# EAGLE design LED_resistor (EAGLE 6.4)
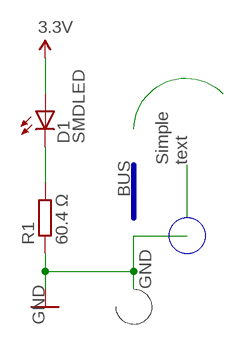
[diagram p0: schematic, sheet 1]

## Parts
D1  SMDLED  [1206]
R1  60.4 Ω  R-EU_R0805  [R0805]

## Nets
3.3V: D1.1(A)
GND: R1.1
N$1: D1.2(C) R1.2

## Buses
BUS

## Notes on the sheet
- Simple
  text

## Library data of the parts
D1 = jenswilly_custom:SMDLED: SMD LED
R1 = rcl:R-EU_: RESISTOR, European symbol

## Board
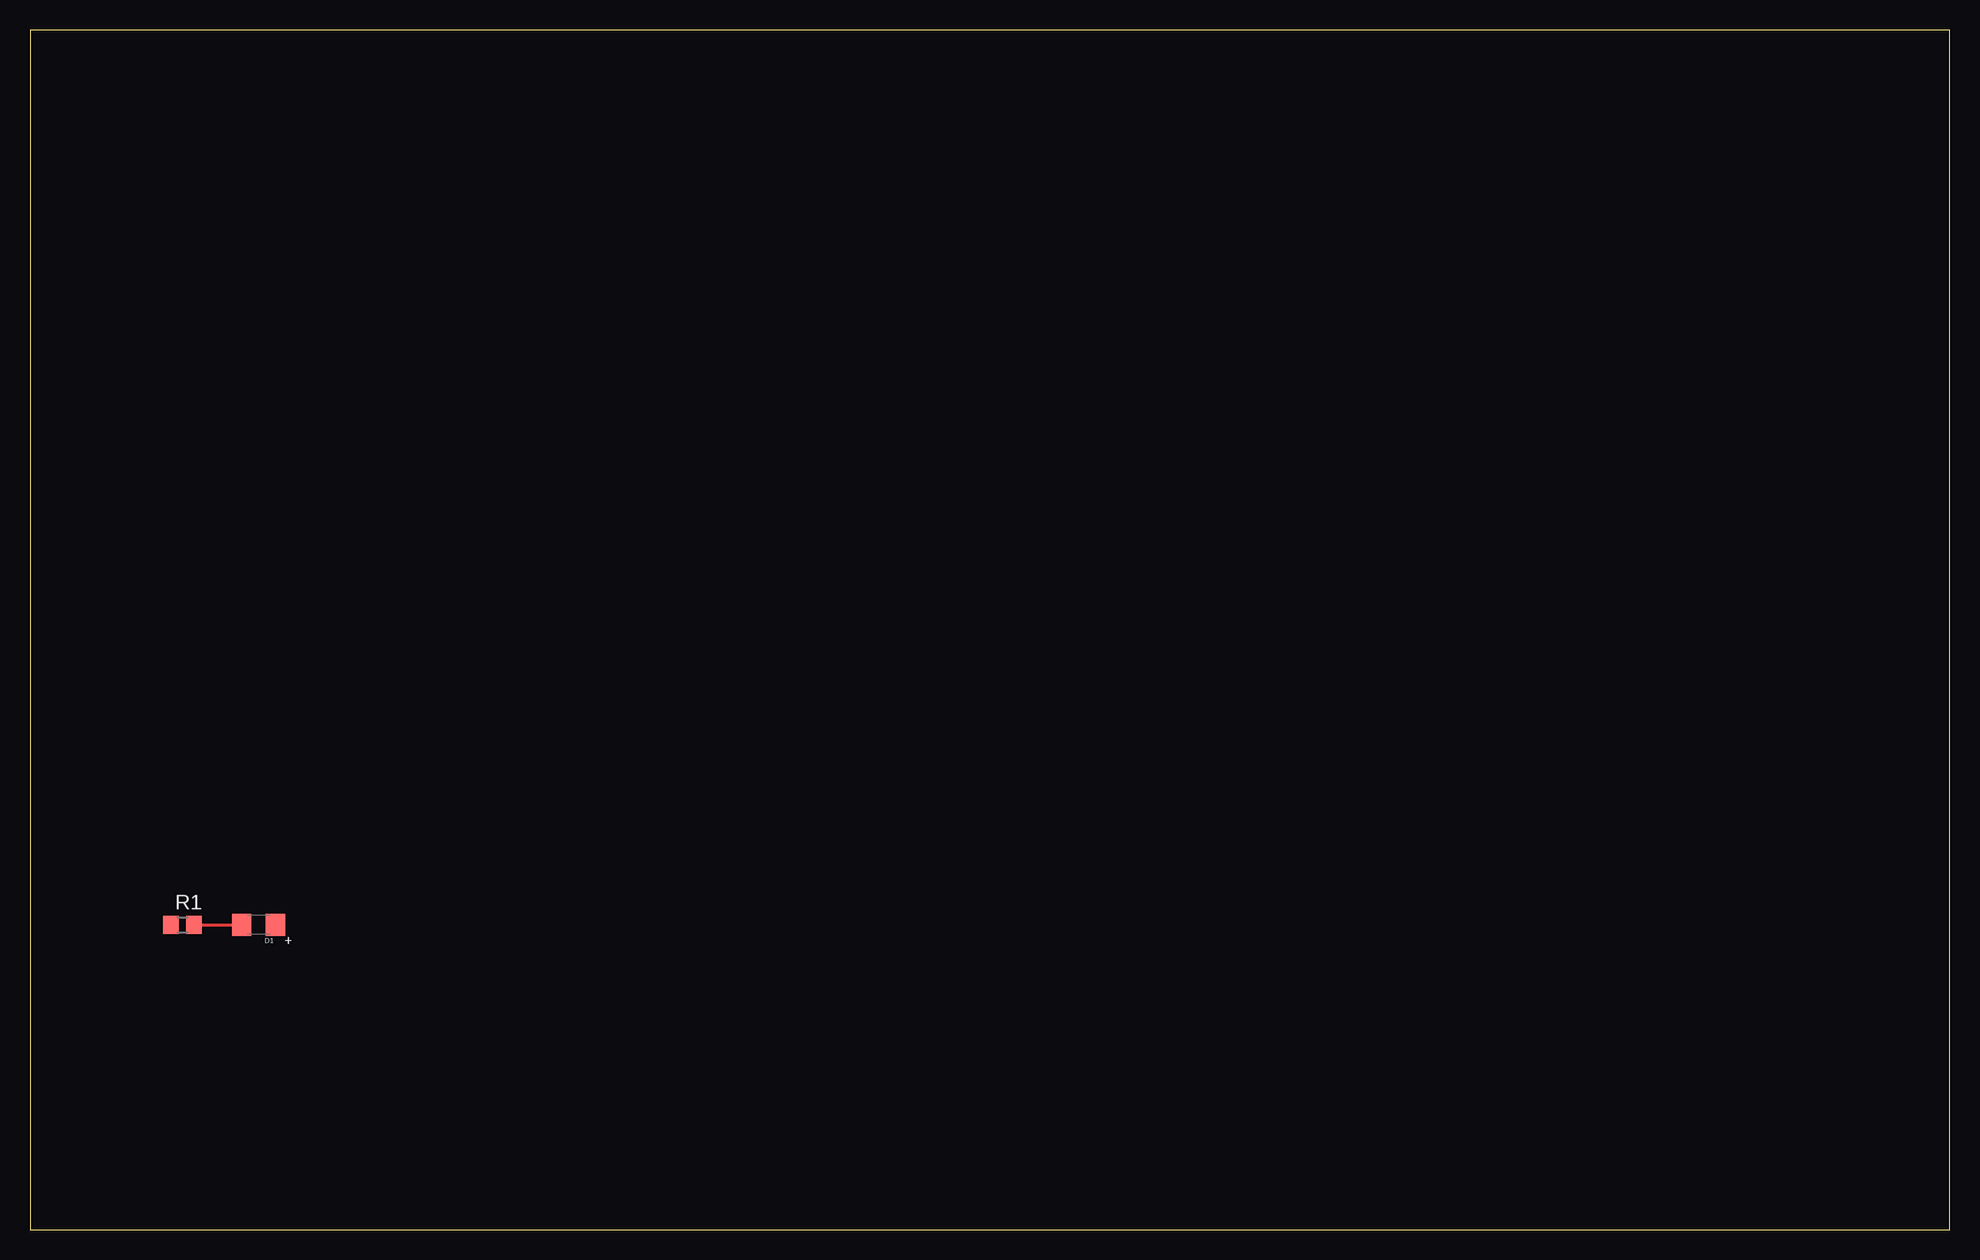
[diagram p1: board, top side]

Size 160 x 100 mm. Coordinates in mm from the lower left corner, seen from the top.
Outline: 0,0 160,0 160,100 0,100 0,0
Copper layers (1*16): Top 0.035mm / dielectric 1.5mm / Bottom 0.035mm
Design rules "default": minimum track width 10mil, minimum drill 24mil, track to track 8mil, track to pad 8mil, pad to pad 8mil, via to via 8mil, smd to smd 8mil, copper to edge 40mil, drill to drill 8mil, minimum pad ring 10mil, minimum via ring 8mil, stop-mask expansion 4mil, vias tented up to drill 0mil, thermal gap 10mil

### Footprints (pad centres in the part's own frame; a part is rotated, then mirrored left to right if it is on the bottom)
1206 = smd 1.6 x 1.8: 1 -1.4,0; 2 1.4,0
R0805 = smd 1.3 x 1.5: 1 -0.95,0; 2 0.95,0

### Placement (x,y rotation side)
D1  19.05,25.4 180 top
R1  12.7,25.4 0 top

### Tracks (layer width: path | path; a pad name or v marks a point on that pad's centre or on a via)
N$1
  Top 0.254: R1.2 D1.2